# Altium schematic sheet FPGA_Bypass_3V3.SCHDOC: FPGA Bypass 3V3
size A4; Organization: Altium Limited.; Address1: Level 3, 12a Rodborough Rd; Address2: Frenchs Forest 2086; Address3: NSW; Address4: AUSTRALIA; DocumentNumber: 15; Revision: 6; SheetNumber: 15; SheetTotal: 64; PageSetup: Record=PageOptions|CenterHorizontal=True|CenterVertical=True|PrintScale=0.97|XCorrection=1.00|YCorrection=1.00|PrintKind=0|BorderSize=5000000|LeftOffset=0|BottomOffset=0|Orientation=2|PaperLength=1000|PaperWidth=1000|Scale=100|PaperSource=7|PrintQuality=-4|MediaType=1|DitherType=10|PaperKind=A4 (210 x 297 mm)|PrintScaleMode=1
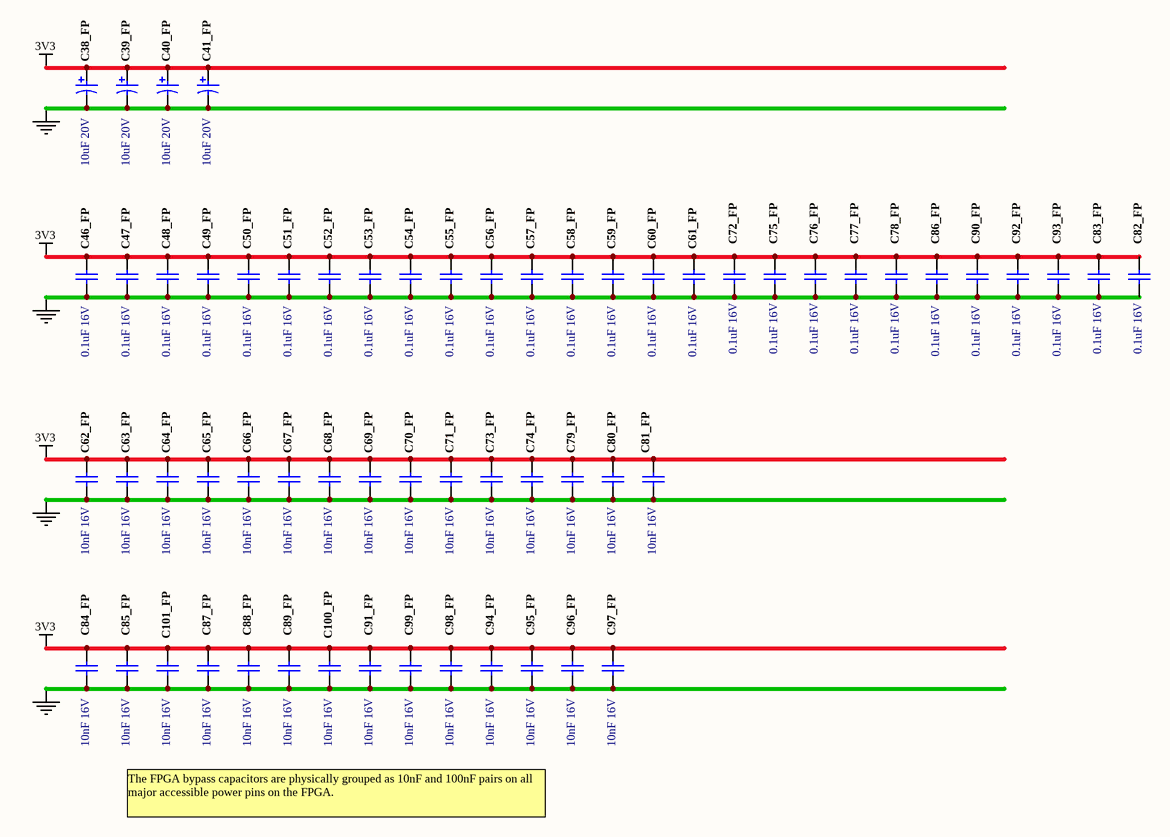
[diagram p0: FPGA_Bypass_3V3.SCHDOC]

## Parts
C38_FP  10uF 20V  [CAPC3528-STAR]
C39_FP  10uF 20V  [CAPC3528-STAR]
C40_FP  10uF 20V  [CAPC3528-STAR]
C41_FP  10uF 20V  [CAPC3528-STAR]
C46_FP  0.1uF 16V  [CAPC1005-STAR]
C47_FP  0.1uF 16V  [CAPC1005-STAR]
C48_FP  0.1uF 16V  [CAPC1005-STAR]
C49_FP  0.1uF 16V  [CAPC1005-STAR]
C50_FP  0.1uF 16V  [CAPC1005-STAR]
C51_FP  0.1uF 16V  [CAPC1005-STAR]
C52_FP  0.1uF 16V  [CAPC1005-STAR]
C53_FP  0.1uF 16V  [CAPC1005-STAR]
C54_FP  0.1uF 16V  [CAPC1005-STAR]
C55_FP  0.1uF 16V  [CAPC1005-STAR]
C56_FP  0.1uF 16V  [CAPC1005-STAR]
C57_FP  0.1uF 16V  [CAPC1005-STAR]
C58_FP  0.1uF 16V  [CAPC1005-STAR]
C59_FP  0.1uF 16V  [CAPC1005-STAR]
C60_FP  0.1uF 16V  [CAPC1005-STAR]
C61_FP  0.1uF 16V  [CAPC1005-STAR]
C62_FP  10nF 16V  [CAPC1005-STAR]
C63_FP  10nF 16V  [CAPC1005-STAR]
C64_FP  10nF 16V  [CAPC1005-STAR]
C65_FP  10nF 16V  [CAPC1005-STAR]
C66_FP  10nF 16V  [CAPC1005-STAR]
C67_FP  10nF 16V  [CAPC1005-STAR]
C68_FP  10nF 16V  [CAPC1005-STAR]
C69_FP  10nF 16V  [CAPC1005-STAR]
C70_FP  10nF 16V  [CAPC1005-STAR]
C71_FP  10nF 16V  [CAPC1005-STAR]
C72_FP  0.1uF 16V  [CAPC1005-STAR]
C73_FP  10nF 16V  [CAPC1005-STAR]
C74_FP  10nF 16V  [CAPC1005-STAR]
C75_FP  0.1uF 16V  [CAPC1005-STAR]
C76_FP  0.1uF 16V  [CAPC1005-STAR]
C77_FP  0.1uF 16V  [CAPC1005-STAR]
C78_FP  0.1uF 16V  [CAPC1005-STAR]
C79_FP  10nF 16V  [CAPC1005-STAR]
C80_FP  10nF 16V  [CAPC1005-STAR]
C81_FP  10nF 16V  [CAPC1005-STAR]
C82_FP  0.1uF 16V  [CAPC1005-STAR]
C83_FP  0.1uF 16V  [CAPC1005-STAR]
C84_FP  10nF 16V  [CAPC1005-STAR]
C85_FP  10nF 16V  [CAPC1005-STAR]
C86_FP  0.1uF 16V  [CAPC1005-STAR]
C87_FP  10nF 16V  [CAPC1005-STAR]
C88_FP  10nF 16V  [CAPC1005-STAR]
C89_FP  10nF 16V  [CAPC1005-STAR]
C90_FP  0.1uF 16V  [CAPC1005-STAR]
C91_FP  10nF 16V  [CAPC1005-STAR]
C92_FP  0.1uF 16V  [CAPC1005-STAR]
C93_FP  0.1uF 16V  [CAPC1005-STAR]
C94_FP  10nF 16V  [CAPC1005-STAR]
C95_FP  10nF 16V  [CAPC1005-STAR]
C96_FP  10nF 16V  [CAPC1005-STAR]
C97_FP  10nF 16V  [CAPC1005-STAR]
C98_FP  10nF 16V  [CAPC1005-STAR]
C99_FP  10nF 16V  [CAPC1005-STAR]
C100_FP  10nF 16V  [CAPC1005-STAR]
C101_FP  10nF 16V  [CAPC1005-STAR]

## Nets
3V3: C38_FP.1 C39_FP.1 C40_FP.1 C41_FP.1 C46_FP.1 C47_FP.1 C48_FP.1 C49_FP.1 C50_FP.1 C51_FP.1 C52_FP.1 C53_FP.1 C54_FP.1 C55_FP.1 C56_FP.1 C57_FP.1 C58_FP.1 C59_FP.1 C60_FP.1 C61_FP.1 C62_FP.1 C63_FP.1 C64_FP.1 C65_FP.1 C66_FP.1 C67_FP.1 C68_FP.1 C69_FP.1 C70_FP.1 C71_FP.1 C72_FP.1 C73_FP.1 C74_FP.1 C75_FP.1 C76_FP.1 C77_FP.1 C78_FP.1 C79_FP.1 C80_FP.1 C81_FP.1 C82_FP.1 C83_FP.1 C84_FP.1 C85_FP.1 C86_FP.1 C87_FP.1 C88_FP.1 C89_FP.1 C90_FP.1 C91_FP.1 C92_FP.1 C93_FP.1 C94_FP.1 C95_FP.1 C96_FP.1 C97_FP.1 C98_FP.1 C99_FP.1 C100_FP.1 C101_FP.1
GND: C38_FP.2 C39_FP.2 C40_FP.2 C41_FP.2 C46_FP.2 C47_FP.2 C48_FP.2 C49_FP.2 C50_FP.2 C51_FP.2 C52_FP.2 C53_FP.2 C54_FP.2 C55_FP.2 C56_FP.2 C57_FP.2 C58_FP.2 C59_FP.2 C60_FP.2 C61_FP.2 C62_FP.2 C63_FP.2 C64_FP.2 C65_FP.2 C66_FP.2 C67_FP.2 C68_FP.2 C69_FP.2 C70_FP.2 C71_FP.2 C72_FP.2 C73_FP.2 C74_FP.2 C75_FP.2 C76_FP.2 C77_FP.2 C78_FP.2 C79_FP.2 C80_FP.2 C81_FP.2 C82_FP.2 C83_FP.2 C84_FP.2 C85_FP.2 C86_FP.2 C87_FP.2 C88_FP.2 C89_FP.2 C90_FP.2 C91_FP.2 C92_FP.2 C93_FP.2 C94_FP.2 C95_FP.2 C96_FP.2 C97_FP.2 C98_FP.2 C99_FP.2 C100_FP.2 C101_FP.2

## Notes on the sheet
- The FPGA bypass capacitors are physically grouped as 10nF and 100nF pairs on all major accessible power pins on the FPGA.
- Sheet Title
- Project Title
- Size:
- Date:
- A4
- Assy:
- Time:
- Sheet
- Revision:
- of
- File:

## Library data of the parts
C38_FP C39_FP C40_FP C41_FP = D-101-0007: Capacitor, Tantalum, 10uF 10% 20V MCCT-B (3528); Polarity: Polarized; Category: Capacitor; Capacitance: 10 uF; Mounting Technology: Surface Mount; Rated Voltage: 20 V; Status: Production; Technology: Tantalum; Tolerance: 10 %
C46_FP C47_FP C48_FP C49_FP C50_FP C51_FP C52_FP C53_FP C54_FP C55_FP C56_FP C57_FP C58_FP C59_FP C60_FP C61_FP C72_FP C75_FP C76_FP C77_FP C78_FP C82_FP C83_FP C86_FP C90_FP C92_FP C93_FP = D-101-0080: Capacitor, Ceramic, 0.1uF 10% 16V 0402 (1005) X7R; Polarity: Non-Polarized; Category: Capacitor; Capacitance: 0.1 uF; Dielectric: X7R; Mounting Technology: Surface Mount; Rated Voltage: 16 V; Status: Production; Technology: Ceramic; Tolerance: 10 %
C62_FP C63_FP C64_FP C65_FP C66_FP C67_FP C68_FP C69_FP C70_FP C71_FP C73_FP C74_FP C79_FP C80_FP C81_FP C84_FP C85_FP C87_FP C88_FP C89_FP C91_FP C94_FP C95_FP C96_FP C97_FP C98_FP C99_FP C100_FP C101_FP = D-101-0077: Capacitor, Ceramic, 10nF 10% 16V 0402 (1005) X7R; Polarity: Non-Polarized; Category: Capacitor; Capacitance: 10 nF; Dielectric: X7R; Mounting Technology: Surface Mount; Rated Voltage: 16 V; Status: Production; Technology: Ceramic; Tolerance: 10 %